# Altium schematic sheet Power.SchDoc
size A3; Organization: Altium Limited; Address1: L3, 12a Rodborough Rd; Address2: Frenchs Forest; Address3: NSW; Address4: Australia 2086
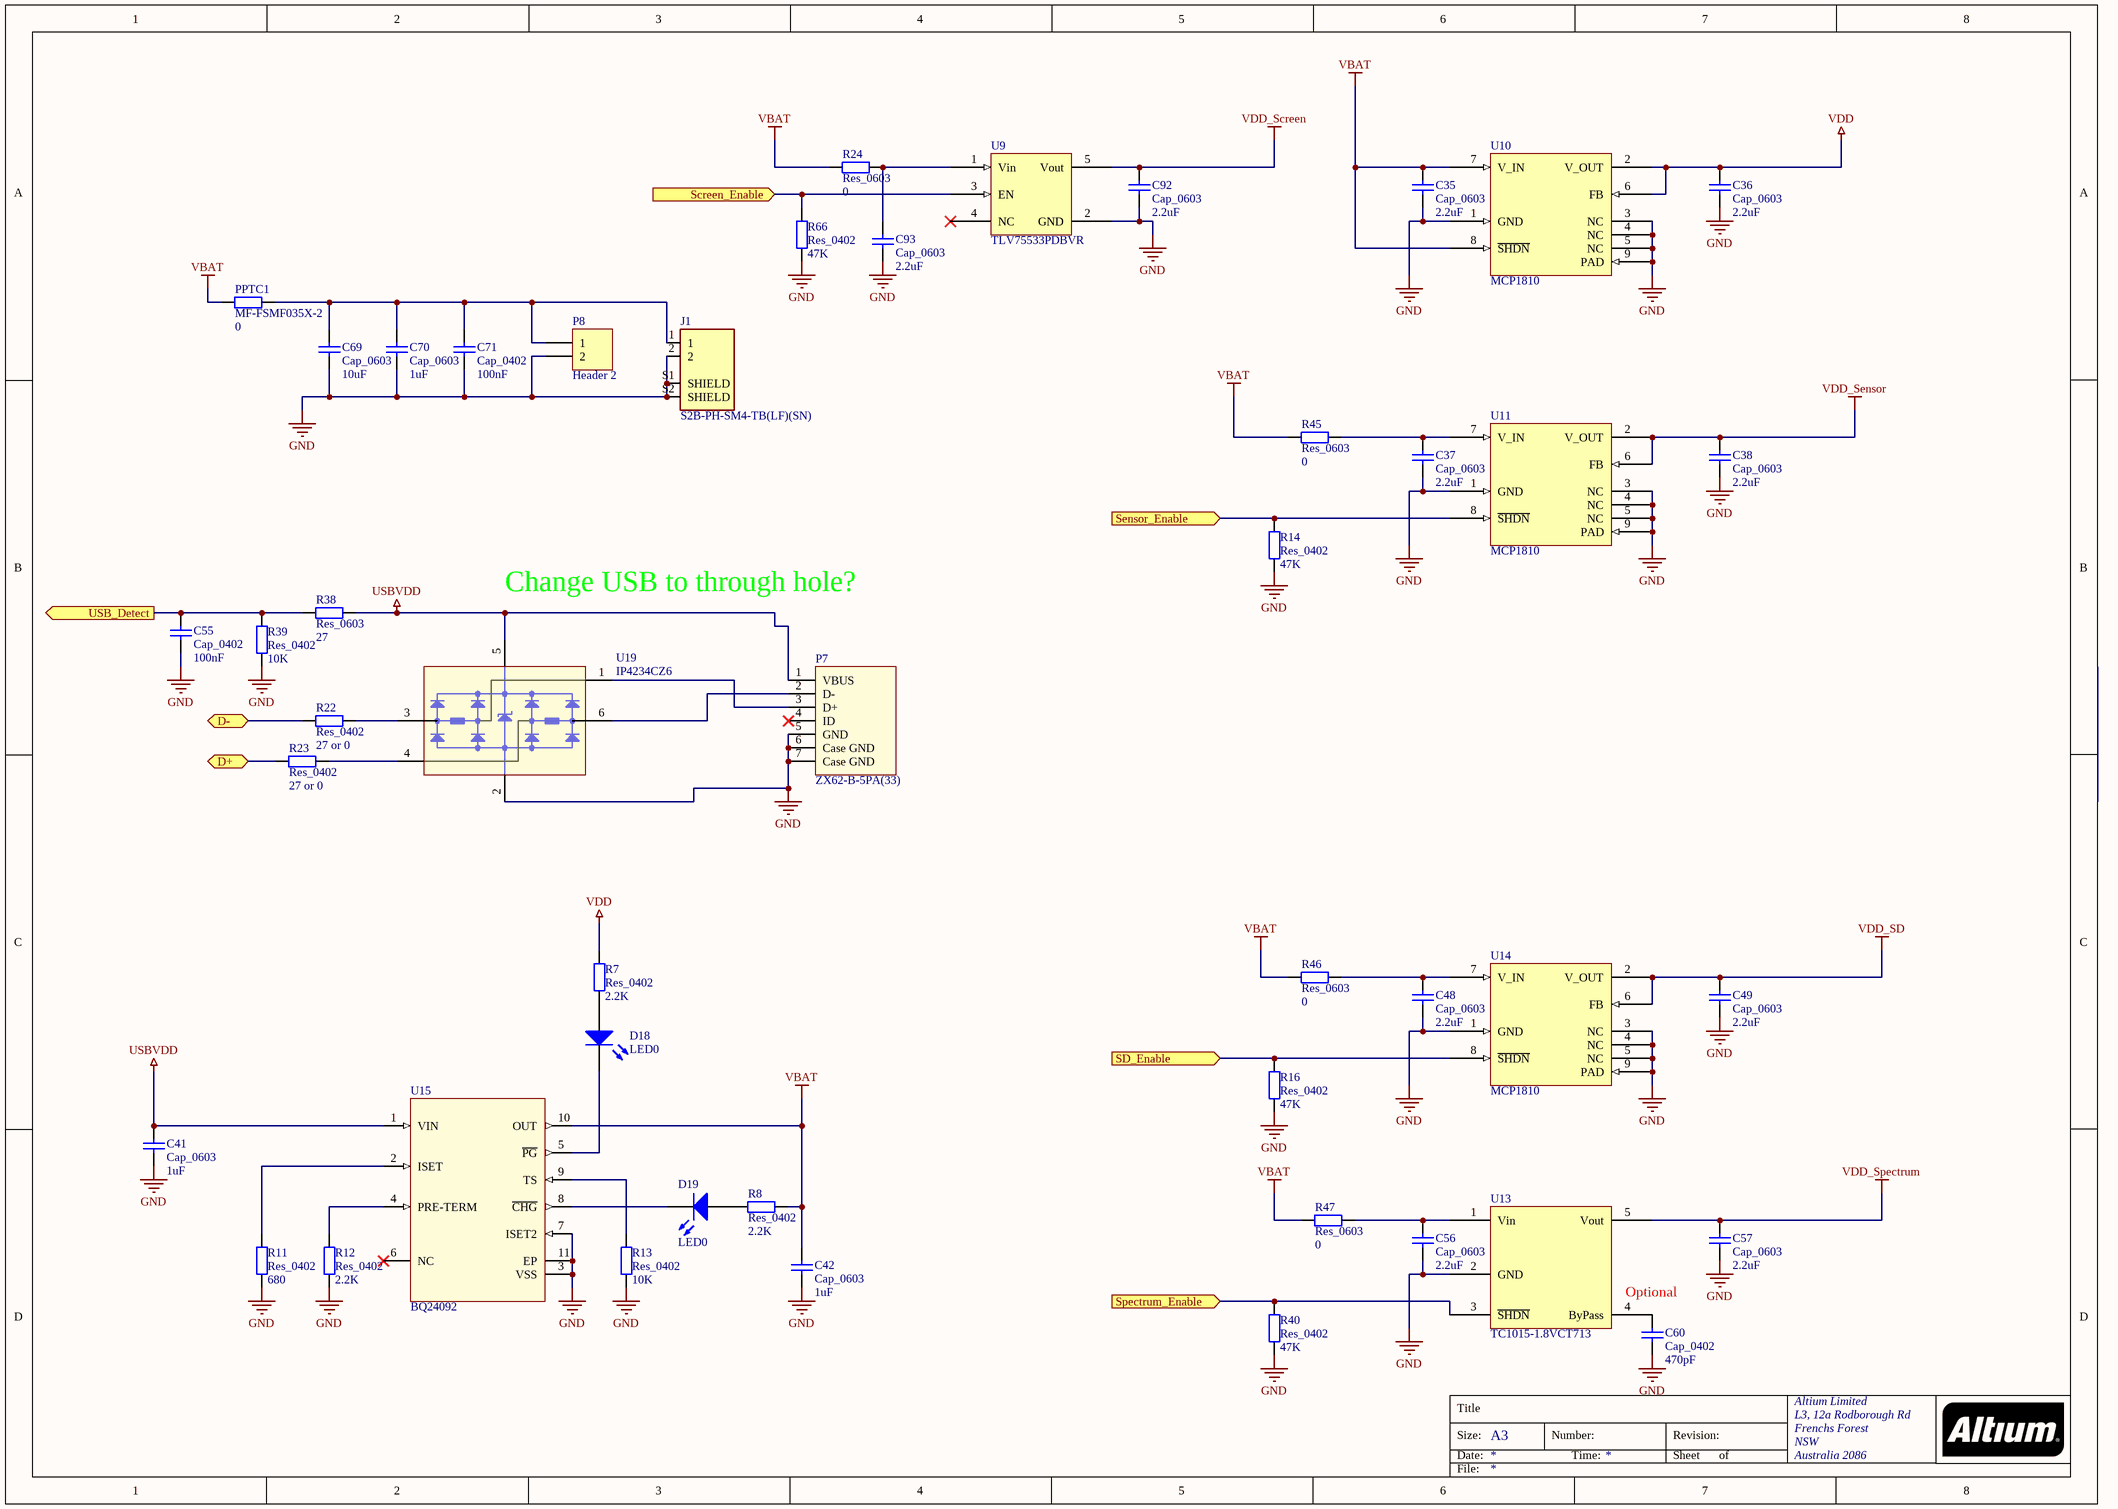
[diagram p0: Power.SchDoc]

## Parts
C35  Cap_0603  value 2.2uF  [0603]
C36  Cap_0603  value 2.2uF  [0603]
C37  Cap_0603  value 2.2uF  [0603]
C38  Cap_0603  value 2.2uF  [0603]
C41  Cap_0603  value 1uF  [0603]
C42  Cap_0603  value 1uF  [0603]
C48  Cap_0603  value 2.2uF  [0603]
C49  Cap_0603  value 2.2uF  [0603]
C55  Cap_0402  value 100nF  [0402]
C56  Cap_0603  value 2.2uF  [0603]
C57  Cap_0603  value 2.2uF  [0603]
C60  Cap_0402  value 470pF  [0402]
C69  Cap_0603  value 10uF  [0603]
C70  Cap_0603  value 1uF  [0603]
C71  Cap_0402  value 100nF  [0402]
C92  Cap_0603  value 2.2uF  [0603]
C93  Cap_0603  value 2.2uF  [0603]
D18  LED0  [0603]
D19  LED0  [0603]
J1  S2B-PH-SM4-TB(LF)(SN)  [JST_S2B-PH-SM4-TB(LF)(SN)]
P7  ZX62-B-5PA(33)  [ZX62-B-5PA(33)]
P8  Header 2  [HDR1X2]
PPTC1  MF-FSMF035X-2  value 0  [0603]
R7  Res_0402  value 2.2K  [0402]
R8  Res_0402  value 2.2K  [0402]
R11  Res_0402  value 680  [0402]
R12  Res_0402  value 2.2K  [0402]
R13  Res_0402  value 10K  [0402]
R14  Res_0402  value 47K  [0402]
R16  Res_0402  value 47K  [0402]
R22  Res_0402  value 27 or 0  [0402]
R23  Res_0402  value 27 or 0  [0402]
R24  Res_0603  value 0  [0603]
R38  Res_0603  value 27  [0603]
R39  Res_0402  value 10K  [0402]
R40  Res_0402  value 47K  [0402]
R45  Res_0603  value 0  [0603]
R46  Res_0603  value 0  [0603]
R47  Res_0603  value 0  [0603]
R66  Res_0402  value 47K  [0402]
U9  TLV75533PDBVR  [SOT-23 (5)]
U10  MCP1810  [VDFN8]
U11  MCP1810  [VDFN8]
U13  TC1015-1.8VCT713  [SOT-23 (5)]
U14  MCP1810  [VDFN8]
U15  BQ24092  [HVSSOP-10]
U19  IP4234CZ6  [TSOP95P280X110_HS-7N]

## Ports
D+ (bidir), D- (bidir), Screen_Enable (in), SD_Enable (in), Sensor_Enable (in), Spectrum_Enable (in), USB_Detect (out)

## Nets
GND: C35.1 C36.1 C37.1 C38.1 C41.1 C42.1 C48.1 C49.1 C55.1 C56.1 C57.1 C60.1 C69.1 C70.1 C71.1 C92.1 C93.1 J1.2 J1.S1(SHIELD) J1.S2(SHIELD) P7.5(GND) P7.6(Case_GND) P7.7(Case_GND) P8.2 R11.1 R12.1 R13.1 R14.2 R16.1 R39.1 R40.2 R66.2 U9.2(GND) U10.1(GND) U10.3(NC) U10.4(NC) U10.5(NC) U10.9(PAD) U11.1(GND) U11.3(NC) U11.4(NC) U11.5(NC) U11.9(PAD) U13.2(GND) U14.1(GND) U14.3(NC) U14.4(NC) U14.5(NC) U14.9(PAD) U15.3(VSS) U15.7(ISET2) U15.11(EP) U19.2(GND)
USBVDD: C41.2 P7.1(VBUS) R38.2 U15.1(VIN) U19.5(VCC)
VBAT: C35.2 C42.2 PPTC1.1 R8.1 R24.1 R45.1 R46.1 R47.1 U10.7(V_IN) U10.8(~{SHDN}) U15.10(OUT)
VDD: C36.2 R7.2 U10.2(V_OUT) U10.6(FB)
VDD_Screen: C92.2 U9.5(Vout)
VDD_SD: C49.2 U14.2(V_OUT) U14.6(FB)
VDD_Sensor: C38.2 U11.2(V_OUT) U11.6(FB)
VDD_Spectrum: C57.2 U13.5(Vout)
D+: R23.1 ; port D+
D-: R22.1 ; port D-
Screen_Enable: R66.1 U9.3(EN) ; port Screen_Enable
SD_Enable: R16.2 U14.8(~{SHDN}) ; port SD_Enable
Sensor_Enable: R14.1 U11.8(~{SHDN}) ; port Sensor_Enable
Spectrum_Enable: R40.1 U13.3(~{SHDN}) ; port Spectrum_Enable
USB_Detect: C55.2 R38.1 R39.2 ; port USB_Detect
NetC37_2: C37.2 R45.2 U11.7(V_IN)
NetC48_2: C48.2 R46.2 U14.7(V_IN)
NetC56_2: C56.2 R47.2 U13.1(Vin)
NetC60_2: C60.2 U13.4(ByPass)
NetC69_2: C69.2 C70.2 C71.2 J1.1 P8.1 PPTC1.2
NetC93_2: C93.2 R24.2 U9.1(Vin)
NetD18_1: D18.1(K) U15.5(~{PG})
NetD18_2: D18.2(A) R7.1
NetD19_1: D19.1(K) U15.8(~{CHG})
NetD19_2: D19.2(A) R8.2
NetP7_2: P7.2(D-) U19.6(CH2_B)
NetP7_3: P7.3(D+) U19.1(CH1_A)
NetR11_2: R11.2 U15.2(ISET)
NetR12_2: R12.2 U15.4(PRE-TERM)
NetR13_2: R13.2 U15.9(TS)
NetR22_2: R22.2 U19.3(CH1_B)
NetR23_2: R23.2 U19.4(CH2_A)

Not connected (* = marked no-connect by the designer): P7 4(ID)*; U9 4(NC)*; U15 6(NC)*

## Notes on the sheet
- Change USB to through hole?
- (near U13) Optional
- Title
- Size:
- Date:
- A3
- Number:
- Time:
- Revision:
- Sheet
- of
- File:

## Library data of the parts
C35-C38 C41 C42 C48 C49 C56 C57 C69 C70 C92 C93 = Cap_0603: Capacitor; Published: 8-Jun-2000; LatestRevisionDate: 17-Jul-2002; LatestRevisionNote: Re-released for DXP Platform.; PackageReference: RAD-0.3; Publisher: Altium Limited; PackageDescription: Radial Cap, Thru-Hole; 2 Leads; 0.3 in Pin Spacing
C55 C60 C71 = Cap_0402: Capacitor; Published: 8-Jun-2000; LatestRevisionDate: 17-Jul-2002; LatestRevisionNote: Re-released for DXP Platform.; PackageReference: RAD-0.3; Publisher: Altium Limited; PackageDescription: Radial Cap, Thru-Hole; 2 Leads; 0.3 in Pin Spacing
D18 D19 = LED0: Typical INFRARED GaAs LED; Published: 8-Jun-2000; LatestRevisionDate: 08-Jul-2005; LatestRevisionNote: Mech Layer 1 removed.; PackageReference: LED-0; Publisher: Altium Limited; PackageDescription: LED; 2 Leads
J1 = S2B-PH-SM4-TB(LF)(SN): PH Series 2 Position 2 mm Pitch Surface Mount Side Entry Shrouded Header; MF: {'manufacturer': u'JST Sales'}; MP: S2B-PH-SM4-TB(LF)(SN); Availability: Unavailable; Package: None; Price: None; Value: *
P7 = ZX62-B-5PA(33): USB Connector
P8 = Header 2: Header, 2-Pin; LatestRevisionDate: 17-Jul-2002; LatestRevisionNote: Re-released for DXP Platform.; Publisher: Altium Limited
PPTC1 = MF-FSMF035X-2: PPTC_0603; Published: 8-Jun-2000; LatestRevisionDate: 17-Jul-2002; LatestRevisionNote: Re-released for DXP Platform.; PackageReference: AXIAL-0.4; Publisher: Altium Limited; PackageDescription: Axial Device, Thru-Hole; 2 Leads; 0.4 in Pin Spacing
R7 R8 R11-R14 R16 R22 R23 R39 R40 R66 = Res_0402: Resistor; Published: 8-Jun-2000; LatestRevisionDate: 17-Jul-2002; LatestRevisionNote: Re-released for DXP Platform.; PackageReference: AXIAL-0.4; Publisher: Altium Limited; PackageDescription: Axial Device, Thru-Hole; 2 Leads; 0.4 in Pin Spacing
R24 R38 R45-R47 = Res_0603: Resistor; Published: 8-Jun-2000; LatestRevisionDate: 17-Jul-2002; LatestRevisionNote: Re-released for DXP Platform.; PackageReference: AXIAL-0.4; Publisher: Altium Limited; PackageDescription: Axial Device, Thru-Hole; 2 Leads; 0.4 in Pin Spacing
U9 = TLV75533PDBVR: 3.3V regulator
U10 U11 U14 = MCP1810: 3V Regulator, 150 mA
U13 = TC1015-1.8VCT713: 1.8V Regulator
U15 = BQ24092: Battery Charger
U19 = IP4234CZ6: USB Line Protection